# EAGLE design esp32_cam_rev_B (EAGLE 9.3.2)
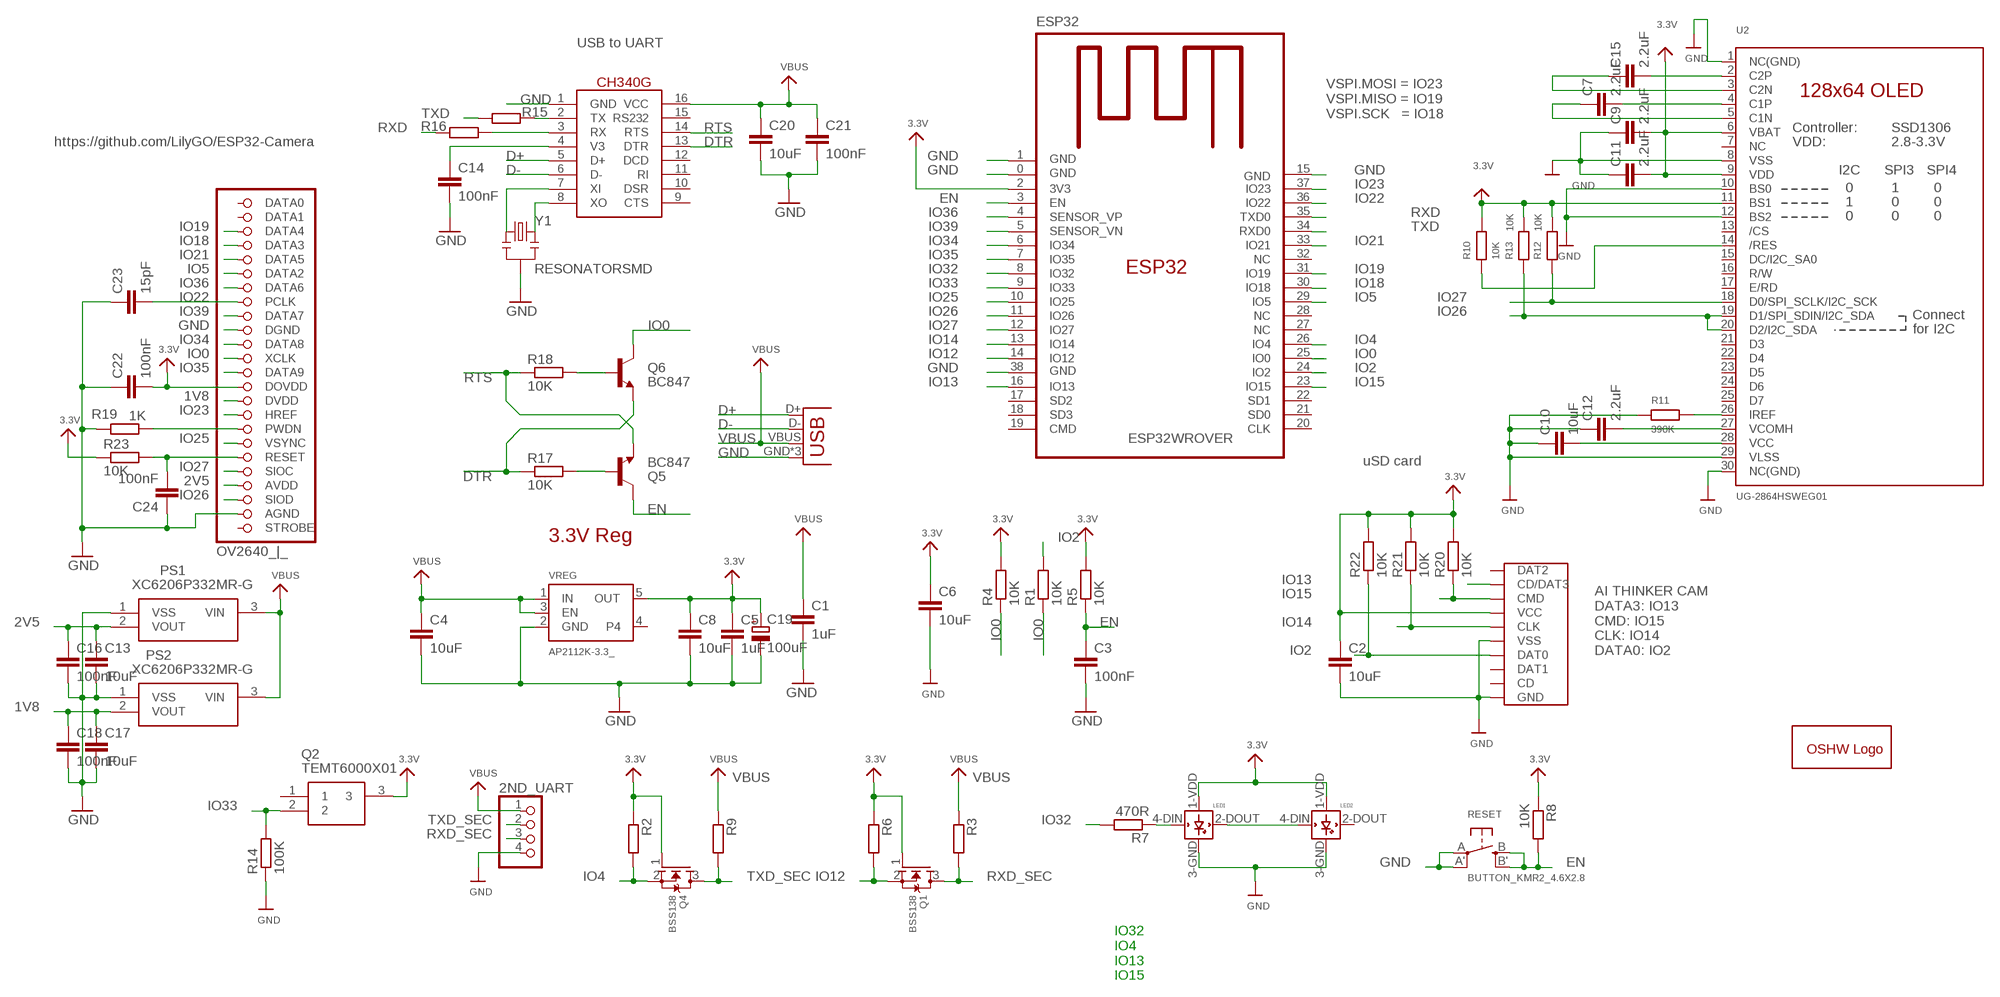
[diagram p0: schematic, sheet 1]

## Parts
2ND_UART  JST_PH4  [JSTPH4]
C1  1uF  C-EUC0805K  [C0805K]
C2  10uF  C-EUC0805  [C0805]
C3  100nF  C-EUC0805K  [C0805K]
C4  10uF  C-EUC0805  [C0805]
C5  1uF  C-EUC0805  [C0805]
C6  10uF  C-EUC0805K  [C0805K]
C7  2.2uF  C-EUC0805  [C0805]
C8  10uF  C-EUC0805  [C0805]
C9  2.2uF  C-EUC0805  [C0805]
C10  10uF  C-EUC0805  [C0805]
C11  2.2uF  C-EUC0805  [C0805]
C12  2.2uF  C-EUC0805  [C0805]
C13  10uF  C-EUC0805  [C0805]
C14  100nF  C-EUC0805K  [C0805K]
C15  2.2uF  C-EUC0805  [C0805]
C16  100nF  C-EUC0805  [C0805]
C17  10uF  C-EUC0805  [C0805]
C18  100nF  C-EUC0805  [C0805]
C19  100uF  CPOL-EUCT6032  [CT6032]
C20  10uF  C-EUC0805  [C0805]
C21  100nF  C-EUC0805  [C0805]
C22  100nF  C-EUC0805  [C0805]
C23  15pF  C-EUC0805  [C0805]
C24  100nF  C-EUC0805  [C0805]
CH340G  CH340G  [SO16]
ESP32  ESP32WROVER  [ESP32WROVER]
FPC_CONNECTOR  OV2640_|_  [5051102491]
GOLD_ORB_SM1  OSHWLOGO_  [OSHW_5MM_LOGO]
LED1  WS2812B  [WS2812B_5050]
LED2  WS2812B  [WS2812B_5050]
PS1  XC6206P332MR-G  [SOT95P280X130-3N]
PS2  XC6206P332MR-G  [SOT95P280X130-3N]
Q1  BSS138  MOSFET_N_  [SOT95P240X110-3]
Q2  TEMT6000X01  [TEMT6000X01]
Q4  BSS138  MOSFET_N_  [SOT95P240X110-3]
Q5  BC847  TRANSISTOR_NPNSOT23-3  [SOT23-3]
Q6  BC847  TRANSISTOR_NPNSOT23-3  [SOT23-3]
R1  10K  R-EU_R0805  [R0805]
R2  10K  R-EU_R0805  [R0805]
R3  10K  R-EU_R0805  [R0805]
R4  10K  R-EU_R0805  [R0805]
R5  10K  R-EU_R0805  [R0805]
R6  10K  R-EU_R0805  [R0805]
R7  470R  R-EU_R0805  [R0805]
R8  10K  R-EU_R0805  [R0805]
R9  10K  R-EU_R0805  [R0805]
R10  10K  R-EU_R0805  [R0805]
R11  390K  R-EU_R0805  [R0805]
R12  10K  R-EU_R0805  [R0805]
R13  10K  R-EU_R0805  [R0805]
R14  100K  R-EU_R0805  [R0805]
R15  470R  R-EU_R0805  [R0805]
R16  470R  R-EU_R0805  [R0805]
R17  10K  R-EU_R0805  [R0805]
R18  10K  R-EU_R0805  [R0805]
R19  1K  R-EU_R0805  [R0805]
R20  10K  R-EU_R0805  [R0805]
R21  10K  R-EU_R0805  [R0805]
R22  10K  R-EU_R0805  [R0805]
R23  10K  R-EU_R0805  [R0805]
RESET  BUTTON_KMR2_4.6X2.8  [BUTTON_KMR2_4.6X2.8]
SD_CARD  MICRO_SD_CARD_  [TFP09-2--12B]
U2  UG-2864HSWEG01  DISP_OLED_UG-2864HSWEG01_  [UG-2864HSWEG01_1.3_WRAPAROUND_MIRRORED]
USB  USB_MICRO_ATTEND_  [USB_MICRO]
VREG  AP2112K-3.3_  [SOT95P290X120-5]
Y1  RESONATORSMD  [RESONATOR-SMD]

## Nets
1V8: C17.1 C18.1 FPC_CONNECTOR.15(DVDD) PS2.2(VOUT)
2V5: C13.1 C16.1 FPC_CONNECTOR.21(AVDD) PS1.2(VOUT)
3.3V: C2.1 C5.1 C6.1 C8.1 C9.2 C11.2 C19.+ C22.2 ESP32.2(3V3) FPC_CONNECTOR.14(DOVDD) LED1.1-VDD(VDD) LED2.1-VDD(VDD) Q1.1(G) Q2.3 Q4.1(G) R2.1 R4.2 R5.2 R6.1 R8.1 R10.2 R12.2 R13.2 R20.2 R21.2 R22.2 R23.1 SD_CARD.VCC U2.6(VBAT) U2.9(VDD) U2.11(BS1) VREG.5(OUT)
D+: CH340G.5(D+) USB.D+
D-: CH340G.6(D-) USB.D-
DTR: CH340G.13(DTR) Q6.2(E) R17.1
EN: C3.1 ESP32.3(EN) Q5.3(C) R5.1 R8.2 RESET.B'(S1) RESET.B(S)
GND: 2ND_UART.4 C1.2 C2.2 C3.2 C4.2 C5.2 C6.2 C8.2 C9.1 C10.1 C11.1 C12.1 C13.2 C14.2 C16.2 C17.2 C18.2 C19.- C20.2 C21.2 C22.1 C23.1 C24.1 CH340G.1(GND) ESP32.0(GND) ESP32.1(GND) ESP32.15(GND) ESP32.38(GND) FPC_CONNECTOR.10(DGND) FPC_CONNECTOR.23(AGND) LED1.3-GND(GND) LED2.3-GND(GND) PS1.1(VSS) PS2.1(VSS) R11.1 R14.1 R19.2 RESET.A'(P1) RESET.A(P) SD_CARD.GND SD_CARD.GND@1(GND) SD_CARD.GND@2(GND) SD_CARD.GND@3(VSS) SD_CARD.VSS(GND) U2.1(NC(GND)) U2.8(VSS) U2.10(BS0) U2.12(BS2) U2.29(VLSS) U2.30(NC(GND)) USB.GND USB.GND@2(GND) USB.GND@3(GND) VREG.2(GND) Y1.2
IO0: ESP32.25(IO0) FPC_CONNECTOR.12(XCLK) Q6.3(C) R1.1 R4.1
IO2: ESP32.24(IO2) R1.2 R22.1 SD_CARD.DAT0
IO4: ESP32.26(IO4) Q4.2(S) R2.2
IO5: ESP32.29(IO5) FPC_CONNECTOR.6(DATA2)
IO12: ESP32.14(IO12) Q1.2(S) R6.2
IO13: ESP32.16(IO13) SD_CARD.CD/DAT3
IO14: ESP32.13(IO14) R21.1 SD_CARD.CLK
IO15: ESP32.23(IO15) R20.1 SD_CARD.CMD
IO18: ESP32.30(IO18) FPC_CONNECTOR.4(DATA3)
IO19: ESP32.31(IO19) FPC_CONNECTOR.3(DATA4)
IO21: ESP32.33(IO21) FPC_CONNECTOR.5(DATA5)
IO22: C23.2 ESP32.36(IO22) FPC_CONNECTOR.8(PCLK)
IO23: ESP32.37(IO23) FPC_CONNECTOR.16(HREF)
IO25: ESP32.10(IO25) FPC_CONNECTOR.18(VSYNC)
IO26: ESP32.11(IO26) FPC_CONNECTOR.22(SIOD) R13.1 U2.19(D1/SPI_SDIN/I2C_SDA) U2.20(D2/I2C_SDA)
IO27: ESP32.12(IO27) FPC_CONNECTOR.20(SIOC) R12.1 U2.18(D0/SPI_SCLK/I2C_SCK)
IO32: ESP32.8(IO32) R7.2
IO33: ESP32.9(IO33) Q2.2 R14.2
IO34: ESP32.6(IO34) FPC_CONNECTOR.11(DATA8)
IO35: ESP32.7(IO35) FPC_CONNECTOR.13(DATA9)
IO36: ESP32.4(SENSOR_VP) FPC_CONNECTOR.7(DATA6)
IO39: ESP32.5(SENSOR_VN) FPC_CONNECTOR.9(DATA7)
N$1: R10.1 U2.14(/RES)
N$2: LED1.4-DIN(DIN) R7.1
N$3: LED1.2-DOUT(DOUT) LED2.4-DIN(DIN)
N$6: R11.2 U2.26(IREF)
N$7: C15.2 U2.2(C2P)
N$8: CH340G.8(XO) Y1.3
N$9: C15.1 U2.3(C2N)
N$10: C7.2 U2.4(C1P)
N$11: C7.1 U2.5(C1N)
N$12: C10.2 U2.28(VCC)
N$13: C12.2 U2.27(VCOMH)
N$16: CH340G.7(XI) Y1.1
N$22: C14.1 CH340G.4(V3)
N$23: CH340G.2(TX) R15.1
N$24: CH340G.3(RX) R16.1
N$25: Q5.1(B) R17.2
N$26: Q6.1(B) R18.2
N$32: FPC_CONNECTOR.17(PWDN) R19.1
N$34: C24.2 FPC_CONNECTOR.19(RESET) R23.2
RTS: CH340G.14(RTS) Q5.2(E) R18.1
RXD: ESP32.35(TXD0) R16.2
RXD_SEC: 2ND_UART.3 Q1.3(D) R3.2
TXD: ESP32.34(RXD0) R15.2
TXD_SEC: 2ND_UART.2 Q4.3(D) R9.2
VBUS: 2ND_UART.1 C1.1 C4.1 C20.1 C21.1 CH340G.16(VCC) PS1.3(VIN) PS2.3(VIN) R3.1 R9.1 USB.VBUS VREG.1(IN) VREG.3(EN)
Unconnected: CH340G.9(CTS) CH340G.10(DSR) CH340G.11(RI) CH340G.12(DCD) CH340G.15(RS232) ESP32.17(SD2) ESP32.18(SD3) ESP32.19(CMD) ESP32.20(CLK) ESP32.21(SD0) ESP32.22(SD1) ESP32.27(NC) ESP32.28(NC) ESP32.32(NC) FPC_CONNECTOR.1(DATA0) FPC_CONNECTOR.2(DATA1) FPC_CONNECTOR.24(STROBE) LED2.2-DOUT(DOUT) Q2.1 SD_CARD.CD SD_CARD.DAT1 SD_CARD.DAT2 U2.7(NC) U2.13(/CS) U2.15(DC/I2C_SA0) U2.16(R/W) U2.17(E/RD) U2.21(D3) U2.22(D4) U2.23(D5) U2.24(D6) U2.25(D7) VREG.4

## Notes on the sheet
- USB to UART
- VSPI.MOSI = IO23
  VSPI.MISO = IO19
  VSPI.SCK   = IO18
- https://github.com/LilyGO/ESP32-Camera
- uSD card
- 3.3V Reg
- AI THINKER CAM 
  DATA3: IO13
  CMD: IO15
  CLK: IO14
  DATA0: IO2
- IO32
  IO4
  IO13
  IO15

## Library data of the parts
2ND_UART = dronecz:JST_PH4: JST 4-Pin Right-Angle Connector 4UConnector: 17312
C1-C18 C20-C24 = rcl:C-EU: CAPACITOR, European symbol; SPICEPREFIX: C
C19 = rcl:CPOL-EU: POLARIZED CAPACITOR, European symbol; SPICEPREFIX: C
CH340G = dronecz:CH340G
ESP32 = dronecz:ESP32WROVER
FPC_CONNECTOR = dronecz:OV2640
GOLD_ORB_SM1 = oshw:OSHWLOGO: The OSHW logo for PCB layout
LED1 LED2 = dronecz:WS2812B
PS1 PS2 = SamacSys_Parts:XC6206P332MR-G: LDO Voltage Regulators Source: Datasheet <https://www.torexsemi.com/file/xc6206/XC6206.pdf>; DESCRIPTION: LDO Voltage Regulators; HEIGHT: 1.3mm; MANUFACTURER_NAME: Torex; MANUFACTURER_PART_NUMBER: XC6206P332MR-G; MOUSER_PART_NUMBER: 865-XC6206P332MR-G
Q1 Q4 = dronecz:MOSFET_N
Q2 = SamacSys_Parts:TEMT6000X01: Ambient Light Sensor 570nm SMD3 Vishay TEMT6000X01 +/-60 Visible Light Phototransistor, Surface Mount 3-Pin 1206 package Source: Datasheet <https://componentsearchengine.com/Datasheets/1/TEMT6000X01.pdf>; DESCRIPTION: Ambient Light Sensor 570nm SMD3 Vishay TEMT6000X01 +/-60 Visible Light Phototransistor, Surface Mount 3-Pin 1206 package; HEIGHT: mm; MANUFACTURER_NAME: Vishay; MANUFACTURER_PART_NUMBER: TEMT6000X01; MOUSER_PART_NUMBER: 78-TEMT6000
Q5 Q6 = SparkFun:TRANSISTOR_NPN: Transistor NPN BJT configuration in SOT23 package. MMBT2222 is the common NPN we use. Double check BCE configuration again layout.
R1-R23 = rcl:R-EU_: RESISTOR, European symbol; SPICEPREFIX: R
RESET = dronecz:BUTTON_KMR2_4.6X2.8: SMT Tact Switches 6x6mm - Digikey: P12940SCT-ND KMR2 (4.6x2.8mm) - Digikey: 401-1426-1-ND EVQ-PQHB55 - Light Touch, 160GF (4.5x4.5mm) - Digikey: P8090SCT-ND Farnell (KMR221NG) - 2845727
SD_CARD = dronecz:MICRO_SD_CARD
U2 = microbuilder:DISP_OLED_UG-2864HSWEG01: UG-2864HSWEG01 OLED display Both 1.3" and 0.96" models share the same FPC tab footprint, only the screen dimensions vary.
USB = dronecz:USB_MICRO_ATTEND: https://www.tme.eu/cz/Document/1cbb1fe1d020818ecbe0fffe16726397/207A-BBA0-R.pdf
VREG = dronecz:AP2112K-3.3
Y1 = SparkFun:RESONATOR: Resonator Small SMD resonator. This is the itty bitty 10/20MHz resonators with built in caps. CSTCE10M0G55 and CSTCE20M0V53. Footprint has been reviewed closely but hasn't been tested yet.

## Board
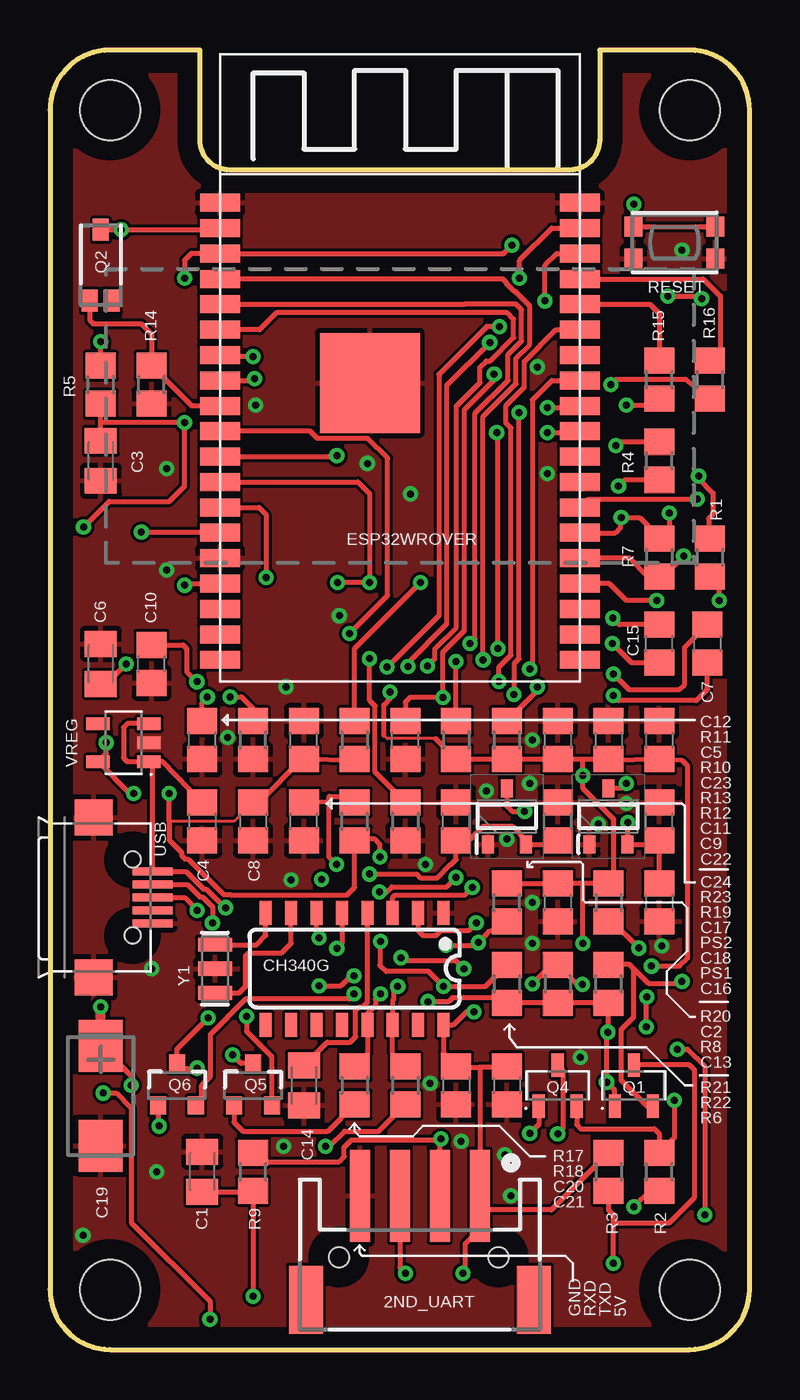
[diagram p1: board, top side]
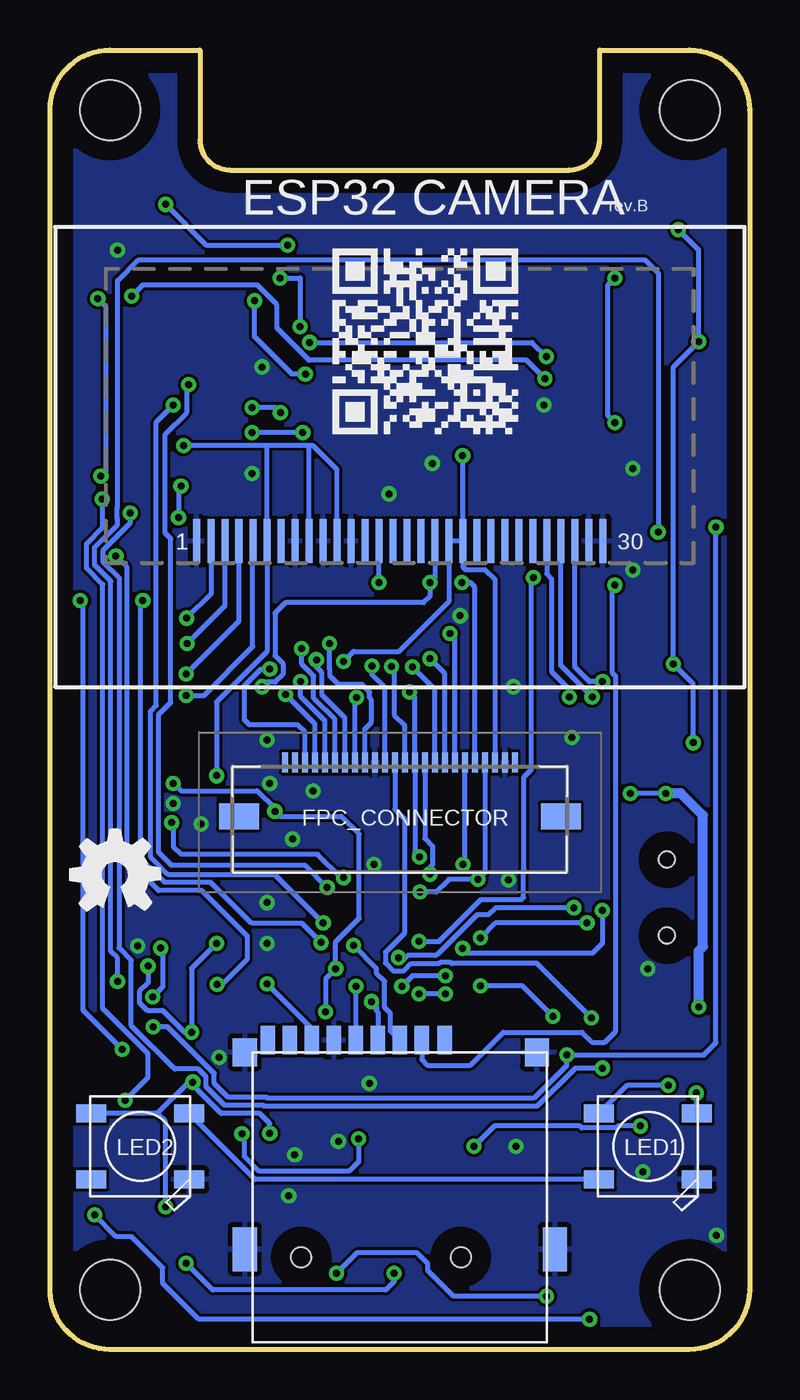
[diagram p2: board, bottom side, seen from below]

Size 35 x 65 mm. Coordinates in mm from the lower left corner, seen from the top.
Outline: 7.5,65 3,65 arc90 0,62 0,3 arc90 3,0 32,0 arc90 35,3 35,62 arc90 32,65 27.5,65 27.5,60.5 arc-90 26,59 9,59 arc-90 7.5,60.5 7.5,65
Copper layers (1*16): Top 0.035mm / dielectric 1.5mm / Bottom 0.035mm
Design rules "default": minimum track width 6mil, minimum drill 0.35mm, track to track 6mil, track to pad 6mil, pad to pad 6mil, via to via 6mil, smd to smd 6mil, copper to edge 40mil, drill to drill 6mil, minimum pad ring 10mil, minimum via ring 8mil, stop-mask expansion 4mil, vias tented up to drill 0mil, thermal gap 10mil
Holes 3 mm at 32,3 3,62 32,62 3,3

### Footprints (pad centres in the part's own frame; a part is rotated, then mirrored left to right if it is on the bottom)
JSTPH4 = smd 1 x 4.6: 1 -3,-3.7; 2 -1,-3.7; 3 1,-3.7; 4 3,-3.7 | smd 1.7 x 3.4: NC1 -5.7,1.5; NC2 5.7,1.5
C0805K = smd 1.3 x 1.6: 1 -1,0; 2 1,0
C0805 = smd 1.3 x 1.5: 1 -0.95,0; 2 0.95,0
CT6032 = smd 2.6 x 2.2: + -2.5,0; - 2.5,0
SO16 = smd 0.6 x 1.2: 1 -4.445,-2.8; 2 -3.175,-2.8; 3 -1.905,-2.8; 4 -0.635,-2.8; 5 0.635,-2.8; 6 1.905,-2.8; 7 3.175,-2.8; 8 4.445,-2.8; 9 4.445,2.8; 10 3.175,2.8; 11 1.905,2.8; 12 0.635,2.8; 13 -0.635,2.8; 14 -1.905,2.8; 15 -3.175,2.8; 16 -4.445,2.8
ESP32WROVER = smd 5 x 5: 0 -1.5,-0.75 | smd 2 x 0.9: 1 -9,8.26; 2 -9,6.99; 3 -9,5.72; 4 -9,4.45; 5 -9,3.18; 6 -9,1.91; 7 -9,0.64; 8 -9,-0.63; 9 -9,-1.9; 10 -9,-3.17; 11 -9,-4.44; 12 -9,-5.71; 13 -9,-6.98; 14 -9,-8.25; 15 -9,-9.52; 16 -9,-10.79; 17 -9,-12.06; 18 -9,-13.33; 19 -9,-14.6; 20 9,-14.6; 21 9,-13.33; 22 9,-12.06; 23 9,-10.79; 24 9,-9.52; 25 9,-8.25; 26 9,-6.98; 27 9,-5.71; 28 9,-4.44; 29 9,-3.17; 30 9,-1.9; 31 9,-0.63; 32 9,0.64; 33 9,1.91; 34 9,3.18; 35 9,4.45; 36 9,5.72; 37 9,6.99; 38 9,8.26
5051102491 = smd 0.3 x 1: 1 -5.75,2.7; 2 -5.25,2.7; 3 -4.75,2.7; 4 -4.25,2.7; 5 -3.75,2.7; 6 -3.25,2.7; 7 -2.75,2.7; 8 -2.25,2.7; 9 -1.75,2.7; 10 -1.25,2.7; 11 -0.75,2.7; 12 -0.25,2.7; 13 0.25,2.7; 14 0.75,2.7; 15 1.25,2.7; 16 1.75,2.7; 17 2.25,2.7; 18 2.75,2.7; 19 3.25,2.7; 20 3.75,2.7; 21 4.25,2.7; 22 4.75,2.7; 23 5.25,2.7; 24 5.75,2.7 | smd 2 x 1.3: 25 8.05,0; 26 -8.05,0
WS2812B_5050 = smd 1.5 x 0.9: 1-VDD 2.45,-1.65; 2-DOUT 2.45,1.65; 3-GND -2.45,1.65; 4-DIN -2.45,-1.65
SOT95P280X130-3N = smd 0.9 x 0.6: 1 -1.4,0.95; 2 -1.4,-0.95; 3 1.4,0
SOT95P240X110-3 = smd 1.18 x 0.609: 1 -1.024,0.95; 2 -1.024,-0.95; 3 1.024,0
TEMT6000X01 = smd 1.1 x 0.8: 1 -1.775,-0.55; 2 -1.775,0.55; 3 1.775,0
SOT23-3 = smd 0.8 x 0.9: 1 -0.95,-1; 2 0.95,-1; 3 0,1.1
R0805 = smd 1.3 x 1.5: 1 -0.95,0; 2 0.95,0
BUTTON_KMR2_4.6X2.8 = smd 0.9 x 1: A 2.05,0.8; A' -2.05,0.8; B 2.05,-0.8; B' -2.05,-0.8
TFP09-2--12B = smd 0.711 x 1.422: CD -6.6,7.85; CD/DAT3 1.1,7.85; CLK -2.2,7.85; CMD 0,7.85; DAT0 -4.4,7.85; DAT1 -5.5,7.85; DAT2 2.25,7.85; VCC -1.1,7.85; VSS -3.3,7.85 | smd 1.2 x 2.2: GND -7.75,-2.6; GND@1 7.75,-2.6 | smd 1.2 x 1.4: GND@2 -7.75,7.25; GND@3 6.85,7.25 | hole 1: -4.93,-3; 3.05,-3
UG-2864HSWEG01_1.3_WRAPAROUND_MIRRORED = smd 0.35 x 2.2 bottom: 1 10.17,-0.2; 2 9.45,-0.2; 3 8.75,-0.2; 4 8.05,-0.2; 5 7.35,-0.2; 6 6.65,-0.2; 7 5.95,-0.2; 8 5.25,-0.2; 9 4.55,-0.2; 10 3.85,-0.2; 11 3.15,-0.2; 12 2.45,-0.2; 13 1.75,-0.2; 14 1.05,-0.2; 15 0.35,-0.2; 16 -0.35,-0.2; 17 -1.05,-0.2; 18 -1.75,-0.2; 19 -2.45,-0.2; 20 -3.15,-0.2; 21 -3.85,-0.2; 22 -4.55,-0.2; 23 -5.25,-0.2; 24 -5.95,-0.2; 25 -6.65,-0.2; 26 -7.35,-0.2; 27 -8.05,-0.2; 28 -8.75,-0.2; 29 -9.45,-0.2; 30 -10.17,-0.2
USB_MICRO = smd 0.4 x 2: D+ 0,3.1; D- -0.65,3.1; GND 1.3,3.1; ID 0.65,3.1; VBUS -1.3,3.1 | smd 1.8 x 1.9: GND@2 -4,0.15; GND@3 4,0.15 | hole 0.8: -1.9,2.1; 1.9,2.1
SOT95P290X120-5 = smd 1.18 x 0.609: 1 -1.274,0.95; 2 -1.274,0; 3 -1.274,-0.95; 4 1.274,-0.95; 5 1.274,0.95
RESONATOR-SMD = smd 0.7 x 1.7: 1 -1.2,0; 2 0,0; 3 1.2,0

### Placement (x,y rotation side)
2ND_UART  18.5,4 180 top
C1  7.62,8.89 90 top
C2  25.4,22.35 270 top
C3  2.54,44.45 270 top
C4  7.62,26.42 270 top
C5  12.7,30.48 90 top
C6  2.54,34.29 90 top
C7  32.89,35.31 90 top
C8  10.16,26.42 270 top
C9  27.94,30.48 270 top
C10  5.08,34.29 90 top
C11  25.4,30.48 270 top
C12  7.62,30.48 90 top
C13  30.48,22.35 270 top
C14  12.7,13.21 270 top
C15  30.48,35.31 90 top
C16  30.48,26.42 90 top
C17  20.32,26.42 90 top
C18  25.4,26.42 90 top
C19  2.54,12.7 270 top
C20  20.32,13.21 270 top
C21  22.86,13.21 270 top
C22  30.48,30.48 270 top
C23  17.78,30.48 90 top
C24  12.7,26.42 90 top
CH340G  15.24,19.05 180 top
ESP32  17.5,49.1 0 top
FPC_CONNECTOR  17.5,26.67 0 bottom
GOLD_ORB_SM1  31.75,23.75 0 bottom
LED1  5.08,10.16 180 bottom
LED2  30.48,10.16 180 bottom
PS1  27.94,26.67 90 top
PS2  22.86,26.67 90 top
Q1  29.21,13.21 90 top
Q2  2.54,54.23 90 top
Q4  25.4,13.21 90 top
Q5  10.16,13.21 0 top
Q6  6.35,13.21 0 top
R1  30.48,39.62 270 top
R2  30.48,8.89 90 top
R3  27.94,8.89 270 top
R4  30.48,44.45 90 top
R5  2.54,48.26 90 top
R6  27.94,18.29 90 top
R7  33.02,39.62 90 top
R8  27.94,22.35 270 top
R9  10.16,8.89 90 top
R10  15.24,30.48 270 top
R11  10.16,30.48 90 top
R12  22.86,30.48 270 top
R13  20.32,30.48 270 top
R14  5.08,48.26 90 top
R15  30.48,48.51 90 top
R16  33.02,48.51 90 top
R17  15.24,13.21 270 top
R18  17.78,13.21 270 top
R19  17.78,26.42 270 top
R20  22.86,22.35 90 top
R21  22.86,18.29 270 top
R22  25.4,18.29 270 top
R23  15.24,26.42 90 top
RESET  31.24,55.37 180 top
SD_CARD  17.5,7.62 0 bottom
U2  17.5,40.64 0 top
USB  2.03,22.61 270 top
VREG  3.68,30.35 180 top
Y1  8.26,19.05 90 top

### Tracks (layer width: path | path; a pad name or v marks a point on that pad's centre or on a via)
1V8  (via drill 0.35)
  Top 0.254: PS2.2 24,25.27 | 24,25.27 25.23,25.27 C18.1 | 24,25.27 23.52,25.75 23.52,25.8 23.13,26.18 21.68,26.18 20.93,25.43 C17.1 20.32,24.51 20.07,24.26 20.05,24.26 19.39,23.6 18.52,23.6 18.35,23.78 v15.98,23.78
  Bottom 0.254: FPC_CONNECTOR.15 16.25,25.56 15.85,25.16 15.85,24.24 15.98,24.11 v15.98,23.78
2V5  (via drill 0.35)
  Top 0.254: C13.1 C16.1 30.31,25.27 PS1.2 28.89,26.34 v28.91,26.35 | v16.49,22.88 16.85,22.88 17.1,23.14 19.86,23.14 v20.32,23.6
  Bottom 0.254: v20.32,23.6 20.45,23.6 21.61,24.77 28.45,24.77 28.83,25.15 28.83,26.27 v28.91,26.35 | v16.49,22.88 15.68,22.88 15.05,23.52 v13.59,23.52 13.25,23.86 FPC_CONNECTOR.21
3.3V  (via drill 0.35)
  Top 0.152: 19.3,30.55 16.86,30.55 16.7,30.71 | C8.1 9.21,26.42 5.97,26.42
  Top 0.254: Q2.3 v3.56,56 8.41,56 ESP32.2 | C8.1 10.49,27.39 12.57,29.48 C5.1 15.19,29.48 R10.2 | 26.67,29.53 C11.2 R12.2 R13.2 19.3,30.55 | 26.67,29.53 C9.2 27.99,29.48 C22.2 31.61,29.48 31.88,29.21 31.88,19.56 31.5,19.18 v30.1,19.18 | v4.19,27.81 4,27.81 VREG.5 2.82,29.81 v2.82,30.35 | v18.92,17.4 19.93,17.4 20.13,17.59 22.61,17.59 R21.2 R22.2 R6.1 27.94,15.9 v27.92,15.88 27.85,15.81 v27.85,13.37 28.26,12.96 Q1.1 | Q4.1 24.45,11.27 v24,10.82 | R2.1 30.03,7.94 v29.22,7.13 | C19.+ 4.06,13.68 v4.06,13.21 | R4.2 28.51,45.4 v28.32,45.21 | v3.81,34.29 2.81,33.29 C6.1 | R5.2 v2.54,50.42 | v16.51,24.64 16.51,25.27 16.26,25.53 15.3,25.53 R23.1 15.24,23.11 14.86,22.73 9.08,22.73 9.06,22.76 8.69,22.76 6.91,24.54 6.75,24.54 6.59,24.7 6.59,24.85 5.97,25.48 5.97,26.42 v5.97,27.81 | 16.7,30.71 16.7,32.25 17.02,32.56 v17.02,32.89 | 26.67,29.53 v26.67,28.7 26.67,28.07 28.19,26.54 28.19,23.56 R8.1 26.67,23.3 | R20.2 C2.1 26.67,23.3 | v26.67,20.32 26.67,23.3
  Top 0.508: C19.+ v2.54,17.14
  Bottom 0.254: v4.19,27.81 v5.97,27.81 | v18.92,17.4 18.67,17.15 18.67,16.95 18.6,16.88 SD_CARD.VCC | 29.62,11.81 LED2.1-VDD | v24,10.82 24,11.3 24.51,11.81 26.43,11.81 27.85,13.22 v27.85,13.37 28.06,13.37 29.62,11.81 | v29.22,7.13 29.22,11.4 29.62,11.81 | v26.67,20.32 27.92,19.07 v27.92,15.88 28.27,15.88 29.37,16.97 30.14,16.97 30.52,17.36 30.52,17.9 30.1,18.33 v30.1,19.18 | v4.06,13.21 6.13,13.21 LED1.1-VDD | 24.13,45.21 v28.32,45.21 | U2.11 20.65,44.02 21.84,45.21 21.97,45.21 | 21.97,45.21 24.13,45.21 | 21.97,45.21 22.05,45.13 U2.9 | 24.13,45.21 24.15,45.19 U2.6 24.15,34.91 26.67,32.38 v26.67,28.7 | v2.82,30.35 2.82,33.3 v3.81,34.29 3.81,49.15 v2.54,50.42 2.54,54.99 v3.56,56 | v16.51,24.64 16.75,24.88 FPC_CONNECTOR.14 16.75,32.62 v17.02,32.89
  Bottom 0.508: v2.54,17.14 2.54,19.94 2.33,20.14 2.33,26.72 3.43,27.81 v4.19,27.81
D+  (via drill 0.35)
  Top 0.254: USB.D+ 6.73,22.61 v7.37,21.97 | CH340G.5 14.61,20.32 v14.35,20.07
  Bottom 0.254: v7.37,21.97 7.37,20.31 7.84,19.83 14.12,19.83 v14.35,20.07
D-  (via drill 0.35)
  Top 0.254: USB.D- 6.88,23.26 7.51,22.63 7.64,22.63 8.13,22.14 v8.13,21.34 | v13.47,20.6 13.34,20.73 CH340G.6
  Bottom 0.254: v8.13,21.34 12.73,21.34 v13.47,20.6
DTR  (via drill 0.35)
  Top 0.254: R17.1 15.88,14.79 CH340G.13 15.88,16.81 16.28,17.21 16.28,17.53 v16.53,17.78 | v15.22,17.79 14.96,17.53 9.79,17.53 8.03,15.77 8.03,13.65 7.6,13.23 7.6,12.51 Q6.2
  Bottom 0.254: v15.22,17.79 v16.53,17.79 v16.53,17.78
EN  (via drill 0.35)
  Top 0.254: C3.1 2.54,46.35 | 2.54,46.35 R5.1 | v6.73,53.59 6.73,54.48 7.07,54.82 ESP32.3 22.69,54.82 v23.11,55.24 | 2.54,46.35 v6.73,46.35 6.73,43.18 5.97,42.42 2.96,42.42 v1.68,41.13 | Q5.3 9.57,14.31 v9.14,14.73 | RESET.B 29.21,56.17 | 29.21,56.17 RESET.B' | v29.21,57.28 29.21,56.17 | R8.2 28.07,21.47 v29.46,20.08 | v29.84,16.13 29.84,17.61 v29.87,17.63
  Bottom 0.254: v6.73,53.59 7.11,53.21 7.11,46.74 v6.73,46.35 | v1.68,41.13 1.68,15.34 2.29,14.73 v9.14,14.73 9.14,14.22 10.79,12.57 24.12,12.57 24.17,12.62 26.09,12.62 26.79,13.32 26.79,13.81 29.1,16.13 v29.84,16.13 | v29.21,57.28 27.18,55.24 v23.11,55.24 | v29.87,17.63 29.36,18.14 29.36,19.97 v29.46,20.08
GND  (via drill 0.35)
  other vias: 24,28.32 12.06,23.5 5.08,19.05 8.89,30.61 11.81,33.15 24.13,20.32 18.8,24.26 14.48,36.7 11.68,10.16 26.54,14.61 20.57,10.41 5.33,8.89 1.65,5.71 21.84,27.94 22.86,25.53 24.13,30.48 30.61,20.19 24.13,22.35 27.43,26.29 5.84,44.07 18.03,42.8 24.38,49.15 31.62,54.99 10.29,47.24 15.88,44.32 5.84,38.99 24.89,43.81 28.83,27.3 22.75,9.74 23.05,7.68 19.02,13.32
  pour Top: 0,0 35.05,0 35.05,65.15 0.13,65.15 0,65.15
  pour Bottom: 0,0 35.05,0 35.05,65.15 0,65.15
IO0  (via drill 0.35)
  Top 0.254: v7.92,16.59 6.35,15.03 Q6.3 6.58,14.07 v7.37,14.07 | ESP32.25 28.28,40.85 28.53,41.1 28.53,41.57 v28.57,41.61 29.51,41.61 30.48,40.64 R1.1 30.99,41.08 v30.99,41.84 | R4.1 28.77,43.5 v28.45,43.18
  Bottom 0.254: v7.92,16.59 10.63,19.3 14.9,19.3 14.95,19.35 15.49,19.35 15.54,19.3 16.93,19.3 17.3,18.94 17.84,18.94 18.23,19.33 18.23,19.87 17.27,20.82 17.27,26.54 17.75,27.02 FPC_CONNECTOR.12 | v28.45,43.18 28.57,43.05 v28.57,41.61 | v7.37,14.07 8.72,14.07 10.63,12.17 24.29,12.17 24.34,12.22 26.27,12.22 27.19,13.14 27.19,13.64 27.58,14.03 28.76,14.03 30.93,16.2 30.93,19.46 31.55,20.08 31.55,38.6 32.36,39.41 32.36,39.96 30.99,41.33 v30.99,41.84
IO2  (via drill 0.35)
  Top 0.254: ESP32.24 29,39.58 29.91,38.67 R1.2 30.69,38.67 v31.7,39.69 | v24.14,18.29 25.09,19.24 R22.1 26.37,18.27 v26.64,18.27
  Bottom 0.254: SD_CARD.DAT0 21.9,16.05 v24.14,18.29 | v26.64,18.27 26.4,18.27 25.12,19.54 25.12,20.67 27.41,22.96 29.57,22.96 31.14,24.53 31.14,39.13 v31.7,39.69
IO4  (via drill 0.35)
  Top 0.254: Q4.2 26.35,11.24 26.54,11.05 30.23,11.05 30.48,10.79 R2.2 31.24,10.6 v31.24,12.47 | ESP32.26 26.88,42.5 32.34,42.5 v32.38,42.55
  Bottom 0.254: v31.24,12.47 30.1,13.61 30.1,14.79 32.36,17.05 32.36,38.27 33.17,39.08 33.17,40.3 32.36,41.11 32.36,42.55 v32.38,42.55
IO5  (via drill 0.35)
  Top 0.254: v22.41,35.05 22.41,45.82 v22.35,45.87 | v24.89,45.87 26.44,45.87 ESP32.29
  Bottom 0.254: FPC_CONNECTOR.6 20.75,31.52 21.8,32.57 21.8,33.69 22.41,34.29 v22.41,35.05 | v22.35,45.87 v24.89,45.87
IO12  (via drill 0.35)
  Top 0.254: R6.2 27.94,19.26 29,19.26 29.21,19.05 | v4.57,40.89 8.46,40.89 ESP32.14 | Q1.2 29.85,12.18 28.57,13.46 28.57,16 29.21,16.64 29.21,19.05 | v31.62,18.41 31.5,18.29 29.97,18.29 29.21,19.05
  Bottom 0.254: v4.57,40.89 4.57,53.85 5.21,54.48 30.61,54.48 31.62,53.47 31.62,42.14 31.65,42.12 31.65,41.57 31.62,41.55 31.62,41.27 32.77,40.13 32.77,39.25 31.95,38.43 31.95,19.91 31.62,19.58 v31.62,18.41
IO13  (via drill 0.35)
  Top 0.254: v6.73,38.23 6.81,38.31 ESP32.16
  Bottom 0.254: SD_CARD.CD/DAT3 16.4,14.49 16.13,14.22 13.97,14.22 12.32,15.88 8.38,15.88 7.87,15.37 7.24,15.37 6.69,15.91 6.69,33.67 6.86,33.84 6.86,38.1 v6.73,38.23
IO14  (via drill 0.35)
  Top 0.254: R21.1 21.78,18.16 v19.68,18.16 18.95,18.9 16.83,18.9 16.51,19.22 16.51,20.39 v16.53,20.41 | v10.81,38.61 10.81,41.77 10.46,42.12 ESP32.13
  Bottom 0.254: SD_CARD.CLK 19.7,18.15 v19.68,18.16 | v10.81,38.61 10.94,38.48 10.94,29 11.28,28.65 11.28,24.02 11.3,24 11.3,22.61 11.4,22.5 13.45,22.5 14.66,21.29 15.54,20.41 v16.53,20.41
IO15  (via drill 0.35)
  Top 0.254: v19.82,20.22 21.29,20.22 v21.43,20.35 21.83,20.75 21.83,20.77 21.99,20.93 22.01,20.93 R20.1 | v30.35,37.47 28.83,37.47 27.98,38.31 ESP32.23
  Bottom 0.254: SD_CARD.CMD 17.96,15.94 17.96,16.82 18.26,17.12 18.26,18.43 18.68,18.84 18.68,19.07 v19.82,20.22 | v30.35,37.47 30.48,37.34 30.48,24.57 29.27,23.36 26.96,23.36 24.91,21.31 22.39,21.31 v21.43,20.35
IO18  (via drill 0.35)
  Top 0.254: v23.22,32.77 23.22,34.31 23.47,34.56 v23.47,46.86 | v24.89,47.12 26.42,47.12 ESP32.30
  Bottom 0.254: FPC_CONNECTOR.4 21.75,31.3 v23.22,32.77 | v23.47,46.86 23.73,47.12 v24.89,47.12
IO19  (via drill 0.35)
  Top 0.254: v24,34.04 24.13,34.16 24.13,47.5 25.1,48.47 ESP32.31
  Bottom 0.254: FPC_CONNECTOR.3 22.25,30.89 22.61,31.24 25.02,31.24 25.27,31.5 25.27,33.21 24.44,34.04 v24,34.04
IO21  (via drill 0.35)
  Top 0.254: v22.46,33.42 22.46,34.13 23.06,34.73 23.06,46.09 22.82,46.34 22.82,47.22 23.73,48.13 23.73,49.42 25.32,51.01 ESP32.33
  Bottom 0.254: FPC_CONNECTOR.5 21.25,31.45 22.46,32.66 v22.46,33.42
IO22  (via drill 0.35)
  Top 0.254: C23.2 17.78,32.38 18.01,32.61 v19.66,32.61 19.66,34.88 20.74,35.96 20.74,47.01 22.22,48.5 v22.22,48.79 | v24.77,52.45 24.77,54.23 25.36,54.82 ESP32.36
  Bottom 0.254: FPC_CONNECTOR.8 19.75,32.52 v19.66,32.61 | v22.22,48.79 22.9,48.79 24.77,50.66 v24.77,52.45
IO23  (via drill 0.35)
  Top 0.254: v23.5,53.59 23.5,54.48 25.1,56.09 ESP32.37 | v22.49,51.16 21.85,51.16 19.45,48.77 19.45,36.71 16.89,34.14 v16.87,34.14
  Bottom 0.254: FPC_CONNECTOR.16 15.75,33.02 v16.87,34.14 | v23.5,53.59 22.49,53.59 v22.49,51.16
IO25  (via drill 0.35)
  Top 0.254: v14.99,35.81 16.89,37.72 16.89,44.58 15.9,45.57 13.38,45.57 13.03,45.93 ESP32.10
  Bottom 0.254: FPC_CONNECTOR.18 14.75,35.58 v14.99,35.81
IO26  (via drill 0.35)
  Top 0.254: R13.1 v20.32,34.42 | ESP32.11 14.31,44.66 v14.35,44.7
  Bottom 0.254: U2.20 14.35,39.14 14.22,39.01 13.23,39.01 12.75,38.53 FPC_CONNECTOR.22 | U2.20 U2.19 15.05,37.4 17.53,34.92 19.81,34.92 v20.32,34.42 | v14.35,44.7 U2.20
IO27  (via drill 0.35)
  Top 0.254: v14.39,38.35 v16,38.35 16,42.8 15.41,43.39 ESP32.12 | R12.1 24.38,32.95 v24.38,33.15
  Bottom 0.254: FPC_CONNECTOR.20 13.75,38.13 13.97,38.35 v14.39,38.35 | U2.18 15.75,38.6 v16,38.35 16,37.66 16.3,37.36 23.22,37.36 23.74,36.84 23.74,34.71 23.34,34.31 23.34,33.76 23.73,33.38 24.15,33.38 v24.38,33.15
IO32  (via drill 0.35)
  Top 0.254: ESP32.8 10.15,48.47 v10.24,48.56 | R7.2 32.96,40.63 32.96,41.55 33.17,41.77 33.17,42.84 32.45,43.56 v32.45,43.69 | v30.92,52.68 32.48,52.68 v32.6,52.56
  Bottom 0.254: v10.24,48.56 11.16,49.48 22.04,49.48 23.64,51.08 23.64,52.26 24.62,53.24 30.36,53.24 v30.92,52.68 | v32.6,52.56 32.22,52.18 32.22,43.92 v32.45,43.69
IO33
  Top 0.254: ESP32.9 7.09,47.2 R14.2 5.08,50.8 4.57,51.31 2.16,51.31 1.99,51.48 Q2.2
IO34  (via drill 0.35)
  Top 0.254: ESP32.6 10.5,51.01 11.34,51.86 22.88,51.86 23.19,51.55 23.19,50.61 22.03,49.45 21.83,49.45 21.52,49.14 21.52,48.37 20.33,47.18 20.33,36.12 19.26,35.05 19.26,34.56 v18.89,34.19
  Bottom 0.254: FPC_CONNECTOR.11 18.25,33.11 18.89,33.74 v18.89,34.19
IO35  (via drill 0.35)
  Top 0.254: v10.16,49.66 8.58,49.66 ESP32.7 | v17.91,34.16 17.91,34.35 19.86,36.3 19.86,48.23 v22,50.38
  Bottom 0.254: v17.91,34.16 17.78,34.04 17.78,31.75 17.25,31.22 FPC_CONNECTOR.13 | v22,50.38 10.88,50.38 v10.16,49.66
IO36  (via drill 0.35)
  Top 0.254: v21.67,34.5 21.67,46.66 23.32,48.3 23.32,49.59 24,50.27 24,52.2 23.26,52.94 23.22,52.94 22.84,53.32 22.84,53.36 22.65,53.55 ESP32.4
  Bottom 0.254: FPC_CONNECTOR.7 20.25,31.59 21.4,32.74 21.4,33.86 21.67,34.13 v21.67,34.5
IO39  (via drill 0.35)
  Top 0.254: ESP32.5 20.49,52.28 20.75,52.28 23.3,52.28 23.31,52.29 23.6,52 23.6,50.44 22.91,49.76 22.91,48.47 21.27,46.83 21.27,35.56 v21.02,35.31
  Bottom 0.254: FPC_CONNECTOR.9 19.25,31.04 18.92,31.37 18.92,32.51 19,32.59 19,32.88 19.4,33.27 20.57,33.27 20.99,33.69 20.99,34.03 21.02,34.05 v21.02,35.31
N$1  (via drill 0.35)
  Top 0.254: R10.1 15.24,35.05 v18.54,38.35
  Bottom 0.254: v18.54,38.35 18.55,38.36 U2.14
N$2  (via drill 0.35)
  Top 0.254: v2.67,12.83 3.3,12.83 4.06,12.06 4.06,6.35 8,2.41 v8,1.52 | v31.39,15.02 31.9,15.02 32.77,14.15 v32.77,6.73 | v33.48,37.47 33.48,38.22 R7.1
  Bottom 0.254: LED1.4-DIN 2.63,12.79 v2.67,12.83 | v8,1.52 27.56,1.52 29.36,3.32 29.36,4.09 30.91,5.64 31.68,5.64 v32.77,6.73 | v33.48,37.47 33.35,37.34 33.35,16.98 v31.39,15.02
N$3
  Bottom 0.254: LED1.2-DOUT 24.73,8.51 LED2.4-DIN
N$6  (via drill 0.35)
  Top 0.254: v9.02,32.64 9.59,32.64 10.16,32.06 R11.2
  Bottom 0.254: U2.26 10.15,38.79 9.91,38.55 9.91,33.91 9.02,33.02 v9.02,32.64
N$7  (via drill 0.35)
  Top 0.254: C15.2 28.49,36.26 v28.17,36.58
  Bottom 0.254: U2.2 26.95,37.8 v28.17,36.58
N$8
  Top 0.254: Y1.3 10.34,20.25 10.79,20.7 CH340G.8
N$9  (via drill 0.35)
  Top 0.254: v28.15,35.31 29.1,34.36 C15.1
  Bottom 0.254: v28.15,35.31 26.25,37.2 U2.3
N$10  (via drill 0.35)
  Top 0.254: v28.19,33.78 28.96,33.02 31.5,33.02 31.75,33.27 31.75,35.11 C7.2
  Bottom 0.254: v28.19,33.78 25.55,36.43 U2.4
N$11  (via drill 0.35)
  Top 0.254: v28.19,32.71 28.45,32.45 32.33,32.45 32.89,33.02 C7.1
  Bottom 0.254: v28.19,32.71 27.3,32.71 24.85,35.15 U2.5
N$12  (via drill 0.35)
  Top 0.254: C10.2 6.65,35.24 6.84,35.05 6.84,33.91 v7.35,33.4
  Bottom 0.254: U2.28 8.75,34.15 8,33.4 v7.35,33.4
N$13  (via drill 0.35)
  Top 0.254: C12.2 7.62,32.38 v7.87,32.64
  Bottom 0.254: v7.87,32.64 9.45,34.22 U2.27
N$16
  Top 0.254: Y1.1 9.47,17.85 9.78,18.16 9.78,19.68 9.94,19.84 11.59,19.84 12.06,20.32 CH340G.7
N$22
  Top 0.254: CH340G.4 15.88,17.38 15.62,17.13 15.46,17.13 15.3,16.97 15.3,15.64 15.02,15.37 13.86,15.37 C14.1
N$23  (via drill 0.35)
  Top 0.254: v28.83,47.24 30.16,47.24 R15.1 | CH340G.2 18.41,20.95 18.67,20.7 19.3,20.7 19.57,20.97 20.96,20.97 v21.32,21.34
  Bottom 0.254: v28.83,47.24 29.69,46.39 29.69,32.21 29.97,31.92 29.97,24.64 29.11,23.77 23.76,23.77 v21.32,21.34
N$24  (via drill 0.35)
  Top 0.254: R16.1 31.82,48.51 28.32,48.51 v28.07,48.26 | CH340G.3 17.14,22.61 17.27,22.73 20.75,22.73 v21.13,23.11
  Bottom 0.254: v28.07,48.26 28.17,48.16 28.17,46.84 29.23,45.78 29.23,40.83 28.96,40.56 28.96,32.36 29.57,31.75 29.57,24.87 28.93,24.23 22.25,24.23 v21.13,23.11
N$25
  Top 0.254: Q5.1 9.21,11.36 9.65,10.92 13.9,10.92 R17.2
N$26  (via drill 0.35)
  Top 0.254: Q6.1 5.4,11.24 v5.46,11.18 | v13.78,10.16 13.97,10.16 14.73,10.92 16.44,10.92 R18.2
  Bottom 0.254: v13.78,10.16 12.77,11.18 8.49,11.18 8.4,11.08 6.66,11.08 6.57,11.18 v5.46,11.18
N$32  (via drill 0.35)
  Top 0.254: R19.1 16.27,28.88 16.27,32.2 16,32.47 v16,34.55
  Bottom 0.254: FPC_CONNECTOR.17 15.25,33.8 v16,34.55
N$34  (via drill 0.35)
  Top 0.254: C24.2 13.97,27.42 | R23.2 14.94,27.67 13.97,27.67 13.97,27.42 | 13.97,27.42 13.97,24.62 v14.33,24.26
  Bottom 0.254: v14.33,24.26 14.25,24.34 FPC_CONNECTOR.19
RTS  (via drill 0.35)
  Top 0.254: R18.1 17.14,14.79 CH340G.14 17.14,17.46 17.19,17.51 17.19,17.95 v17.4,18.16 | v13.47,18.19 14.55,18.19 15.06,18.7 v15.22,18.7 | v9.84,16.66 v9.84,16.65 9.84,15.91 11.11,14.64 Q5.2
  Bottom 0.254: v9.84,16.66 11.37,18.19 v13.47,18.19 | v15.22,18.7 16.86,18.7 v17.4,18.16
RXD
  Top 0.254: ESP32.35 32.68,53.55 33.54,52.69 33.54,49.98 R16.2
RXD_SEC  (via drill 0.35)
  Top 0.254: R3.2 27.94,6.99 28.19,6.73 28.19,6.35 | 28.19,6.35 30.99,6.35 32.26,7.62 32.26,13.97 32,14.23 Q1.3 | 2ND_UART.3 17.5,4.09 v17.78,3.81 | v28.19,4.32 28.19,6.35
  Bottom 0.254: v17.78,3.81 17.78,3.39 18.19,2.98 26.85,2.98 v28.19,4.32
TXD
  Top 0.254: ESP32.34 30.02,52.28 30.48,51.82 R15.2
TXD_SEC  (via drill 0.35)
  Top 0.254: v25.4,10.79 25.65,11.05 25.65,13.98 Q4.3 | 2ND_UART.2 19.5,10.48 v19.56,10.54 19.48,10.47 15.07,10.47 14.72,10.12 14.72,9.64 14.48,9.4 10.6,9.4 R9.2
  Bottom 0.254: v19.56,10.54 19.56,9.4 20.04,8.92 24.54,8.92 25.27,9.65 25.27,10.67 v25.4,10.79
VBUS  (via drill 0.35)
  Top 0.254: C4.1 5.64,29.4 VREG.1 | VREG.1 5.13,29.23 USB.VBUS 6.81,23.91 7.68,23.04 7.81,23.04 8.53,22.31 8.53,22.18 8.62,22.1 v8.79,22.1 | VREG.3 3.87,31.3 3.68,31.11 3.68,29.59 3.87,29.4 VREG.1 | 21.5,14.12 2ND_UART.1 21.58,7.62 21.58,6.99 | C1.1 10.11,7.89 R9.1 v10.16,2.67 | v20.66,3.81 20.79,3.93 20.79,5.3 21.58,6.09 21.58,6.99 | v21.21,16.89 20.83,16.89 20.19,16.25 CH340G.16 19.68,14.84 C20.1 20.36,14.12 21.5,14.12 | v20.7,19.05 20.32,19.43 17.73,19.43 v17.57,19.6 | v28.83,28.32 28.57,28.07 PS1.3 | PS2.3 22.86,27.18 23.11,26.92 v23.75,26.92 | C21.1 22.82,14.12 21.5,14.12 | R3.1 25.09,6.99 21.58,6.99
  Bottom 0.254: v10.16,2.67 14.82,2.67 16.09,3.94 16.09,4.28 16.64,4.83 19.65,4.83 v20.66,3.81 | v8.79,22.1 12.7,22.1 13.06,21.74 13.64,21.74 14.26,21.12 15.61,19.76 15.66,19.76 15.71,19.71 17.1,19.71 17.21,19.6 v17.57,19.6 | v21.21,16.89 21.21,18.54 v20.7,19.05 20.7,20.39 19.54,21.56 19.54,25.78 20.43,26.67 23.5,26.67 v23.75,26.92 23.75,27.05 24.64,27.94 28.45,27.94 v28.83,28.32

### Text on the board
bPlace: 30 | 1
tNames: GND | RXD | TXD | 5V
bNames: rev.B | ESP32 CAMERA